# Altium schematic sheet BrauV2_Display.SchDoc
size 420 x 297 mm; PageSetup: Record=PageOptions|CenterHorizontal=True|CenterVertical=True|PrintScale=1.01|XCorrection=1.00|YCorrection=1.00|PrintKind=1|BorderSize=5000000|LeftOffset=0|BottomOffset=0|Orientation=2|PaperLength=1000|PaperWidth=1000|Scale=100|PaperSource=7|PrintQuality=-4|MediaType=1|DitherType=10|PaperKind=A3|PrintScaleMode=1; DocumentNumber: 7; SheetNumber: 7; SheetTotal: 22
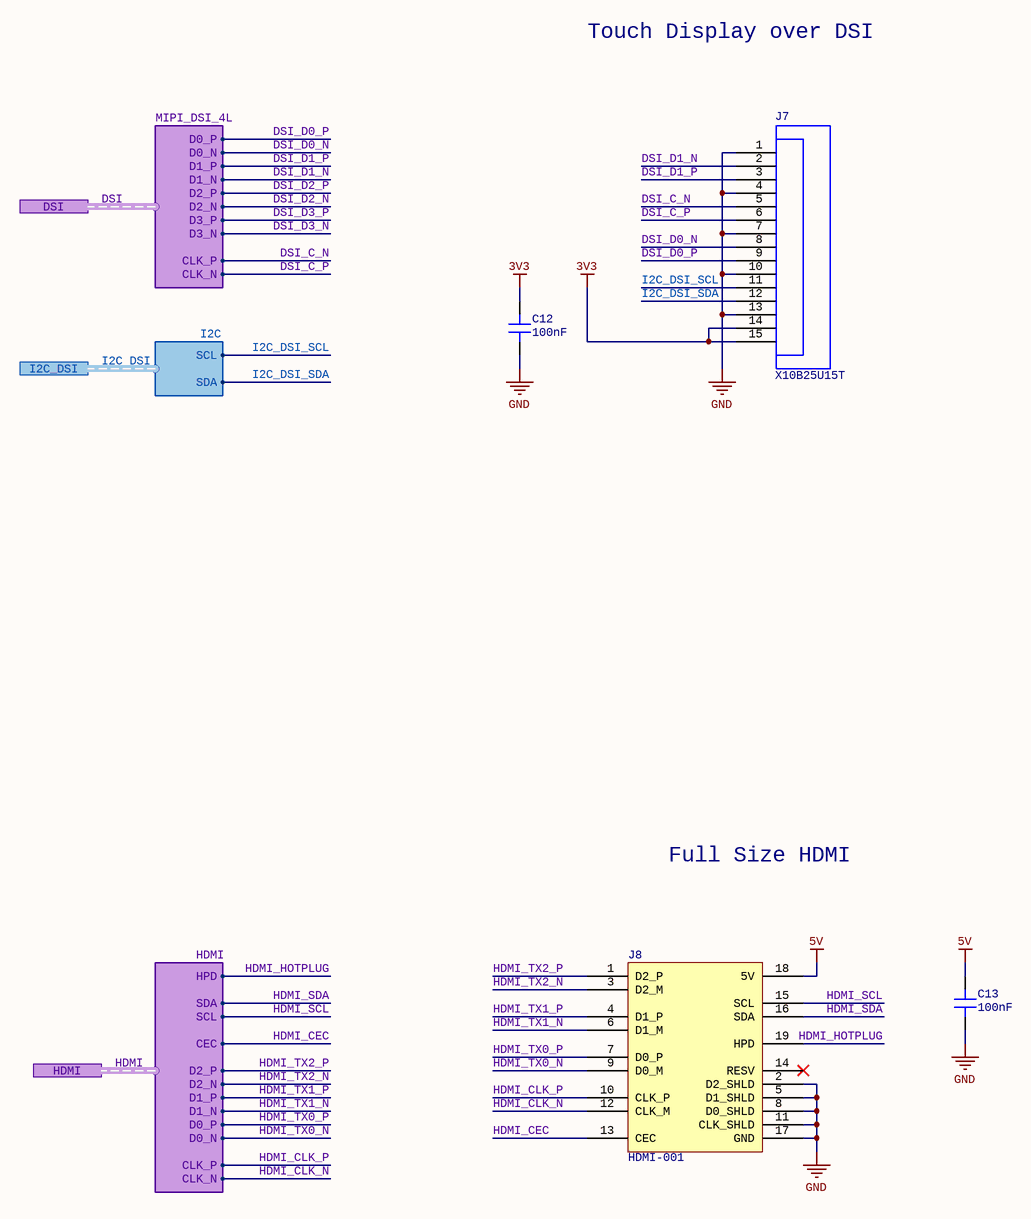
[diagram p0: BrauV2_Display.SchDoc]

## Parts
C12  Capacitance: 100nF  [SMD_CAP_0402(1005)_N]  (hidden comment: CC0402KRX5R6BB104)
C13  Capacitance: 100nF  [SMD_CAP_0402(1005)_N]  (hidden comment: CC0402KRX5R6BB104)
J7  X10B25U15T  [X10B25U15T]
J8  HDMI-001  [HDMI-001]

## Ports
DSI (harness MIPI_DSI_4L), HDMI (harness HDMI), I2C_DSI (harness I2C)

## Harnesses
HDMI: CLK_P, CLK_N, D0_P, D0_N, D2_N, D2_P, D1_N, D1_P, CEC, HPD, SDA, SCL
MIPI_DSI_4L: D1_N, D1_P, D0_P, D0_N, CLK_P, CLK_N, D2_N, D2_P, D3_N, D3_P
I2C: SCL, SDA

## Nets
3V3: C12.2 J7.14 J7.15
5V: C13.2 J8.18(5V)
GND: C12.1 C13.1 J7.1 J7.4 J7.7 J7.10 J7.13 J8.2(D2_SHLD) J8.5(D1_SHLD) J8.8(D0_SHLD) J8.11(CLK_SHLD) J8.17(GND)
DSI_C_N: J7.5 ; port DSI.CLK_P  [project net DSI.CLK_P]
DSI_C_P: J7.6 ; port DSI.CLK_N  [project net DSI.CLK_N]
DSI_D0_N: J7.8 ; port DSI.D0_N  [project net DSI.D0_N]
DSI_D0_P: J7.9 ; port DSI.D0_P  [project net DSI.D0_P]
DSI_D1_N: J7.2 ; port DSI.D1_N  [project net DSI.D1_N]
DSI_D1_P: J7.3 ; port DSI.D1_P  [project net DSI.D1_P]
DSI_D2_N: port DSI.D2_N  [project net DSI.D2_N]
DSI_D2_P: port DSI.D2_P  [project net DSI.D2_P]
DSI_D3_N: port DSI.D3_N  [project net DSI.D3_N]
DSI_D3_P: port DSI.D3_P  [project net DSI.D3_P]
HDMI_CEC: J8.13(CEC) ; port HDMI.CEC  [project net HDMI.CEC]
HDMI_CLK_N: J8.12(CLK_M) ; port HDMI.CLK_N  [project net HDMI.CLK_N]
HDMI_CLK_P: J8.10(CLK_P) ; port HDMI.CLK_P  [project net HDMI.CLK_P]
HDMI_HOTPLUG: J8.19(HPD) ; port HDMI.HPD  [project net HDMI.HPD]
HDMI_SCL: J8.15(SCL) ; port HDMI.SCL  [project net HDMI.SCL]
HDMI_SDA: J8.16(SDA) ; port HDMI.SDA  [project net HDMI.SDA]
HDMI_TX0_N: J8.9(D0_M) ; port HDMI.D0_N  [project net HDMI.D0_N]
HDMI_TX0_P: J8.7(D0_P) ; port HDMI.D0_P  [project net HDMI.D0_P]
HDMI_TX1_N: J8.6(D1_M) ; port HDMI.D1_N  [project net HDMI.D1_N]
HDMI_TX1_P: J8.4(D1_P) ; port HDMI.D1_P  [project net HDMI.D1_P]
HDMI_TX2_N: J8.3(D2_M) ; port HDMI.D2_N  [project net HDMI.D2_N]
HDMI_TX2_P: J8.1(D2_P) ; port HDMI.D2_P  [project net HDMI.D2_P]
I2C_DSI_SCL: J7.11 ; port I2C_DSI.SCL  [project net I2C_DSI.SCL]
I2C_DSI_SDA: J7.12 ; port I2C_DSI.SDA  [project net I2C_DSI.SDA]

Not connected (* = marked no-connect by the designer): J8 14(RESV)*

## Buses and harness runs
harness DSI = port DSI
harness HDMI = port HDMI
harness I2C_DSI = port I2C_DSI

## Notes on the sheet
- Touch Display over DSI
- Full Size HDMI
- FILE NAME
- PROJECT
- TITLE
- REV
- AUTHOR
- SIZE
- SHEET
- DATE
- OF
- A3

## Library data of the parts
C12 C13 = 100nF 0402 10V 10%: 100nF ±10% 10V X5R 0402 Multilayer Ceramic Capacitors MLCC - SMD/SMT RoHS; Package: 0402; Tolerance: 10%; Voltage Rating: 10V
J7 = X10B25U15T: Contact,Top 15 0.039"（1.00mm） 0.098"（2.50mm） Slide Lock SMD FFC, FPC Connectors RoHS
J8 = HDMI-001: BOOMELE(Boom Precision Elec) HDMIconnector 19 Female Horizontal SMD Audio & Video Connectors RoHS